# Altium schematic sheet [10] - FPGA IO BANK 3A.SchDoc
size A3; DocumentNumber: 10; SheetNumber: 10; SheetTotal: 15
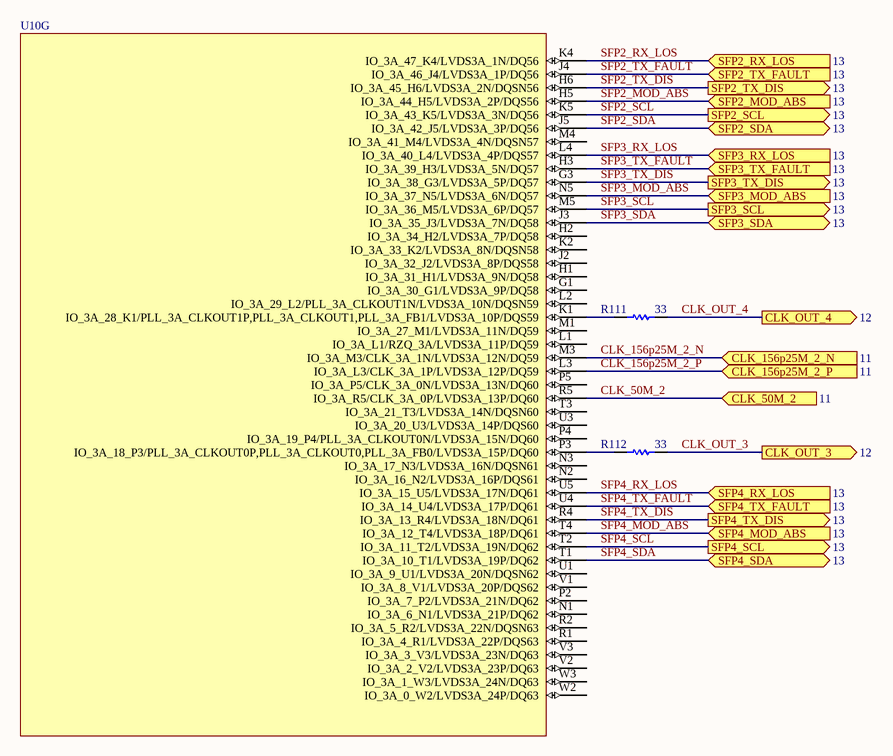
[diagram p0: [10] - FPGA IO BANK 3A.SchDoc]

## Parts
R111  33  [0402_R]
R112  33  [0402_R]
U10  10AX016 F27  [FBGA672]  (value not drawn)  (part G of 12)

## Ports
CLK_50M_2 (in, see 11), CLK_156p25M_2_N (in, see 11), CLK_156p25M_2_P (in, see 11), CLK_OUT_3 (out, see 12), CLK_OUT_4 (out, see 12), SFP2_MOD_ABS (in, see 13), SFP2_RX_LOS (in, see 13), SFP2_SCL (out, see 13), SFP2_SDA (bidir, see 13), SFP2_TX_DIS (out, see 13), SFP2_TX_FAULT (in, see 13), SFP3_MOD_ABS (in, see 13), SFP3_RX_LOS (in, see 13), SFP3_SCL (out, see 13), SFP3_SDA (bidir, see 13), SFP3_TX_DIS (out, see 13), SFP3_TX_FAULT (in, see 13), SFP4_MOD_ABS (in, see 13), SFP4_RX_LOS (in, see 13), SFP4_SCL (out, see 13), SFP4_SDA (bidir, see 13), SFP4_TX_DIS (out, see 13), SFP4_TX_FAULT (in, see 13)

## Nets
CLK_50M_2: U10.R5(IO_3A_R5/CLK_3A_0P/LVDS3A_13P/DQ60) ; port CLK_50M_2
CLK_156p25M_2_N: U10.M3(IO_3A_M3/CLK_3A_1N/LVDS3A_12N/DQ59) ; port CLK_156p25M_2_N
CLK_156p25M_2_P: U10.L3(IO_3A_L3/CLK_3A_1P/LVDS3A_12P/DQ59) ; port CLK_156p25M_2_P
CLK_OUT_3: R112.2 ; port CLK_OUT_3
CLK_OUT_4: R111.2 ; port CLK_OUT_4
SFP2_MOD_ABS: U10.H5(IO_3A_44_H5/LVDS3A_2P/DQS56) ; port SFP2_MOD_ABS
SFP2_RX_LOS: U10.K4(IO_3A_47_K4/LVDS3A_1N/DQ56) ; port SFP2_RX_LOS
SFP2_SCL: U10.K5(IO_3A_43_K5/LVDS3A_3N/DQ56) ; port SFP2_SCL
SFP2_SDA: U10.J5(IO_3A_42_J5/LVDS3A_3P/DQ56) ; port SFP2_SDA
SFP2_TX_DIS: U10.H6(IO_3A_45_H6/LVDS3A_2N/DQSN56) ; port SFP2_TX_DIS
SFP2_TX_FAULT: U10.J4(IO_3A_46_J4/LVDS3A_1P/DQ56) ; port SFP2_TX_FAULT
SFP3_MOD_ABS: U10.N5(IO_3A_37_N5/LVDS3A_6N/DQ57) ; port SFP3_MOD_ABS
SFP3_RX_LOS: U10.L4(IO_3A_40_L4/LVDS3A_4P/DQS57) ; port SFP3_RX_LOS
SFP3_SCL: U10.M5(IO_3A_36_M5/LVDS3A_6P/DQ57) ; port SFP3_SCL
SFP3_SDA: U10.J3(IO_3A_35_J3/LVDS3A_7N/DQ58) ; port SFP3_SDA
SFP3_TX_DIS: U10.G3(IO_3A_38_G3/LVDS3A_5P/DQ57) ; port SFP3_TX_DIS
SFP3_TX_FAULT: U10.H3(IO_3A_39_H3/LVDS3A_5N/DQ57) ; port SFP3_TX_FAULT
SFP4_MOD_ABS: U10.T4(IO_3A_12_T4/LVDS3A_18P/DQ61) ; port SFP4_MOD_ABS
SFP4_RX_LOS: U10.U5(IO_3A_15_U5/LVDS3A_17N/DQ61) ; port SFP4_RX_LOS
SFP4_SCL: U10.T2(IO_3A_11_T2/LVDS3A_19N/DQ62) ; port SFP4_SCL
SFP4_SDA: U10.T1(IO_3A_10_T1/LVDS3A_19P/DQ62) ; port SFP4_SDA
SFP4_TX_DIS: U10.R4(IO_3A_13_R4/LVDS3A_18N/DQ61) ; port SFP4_TX_DIS
SFP4_TX_FAULT: U10.U4(IO_3A_14_U4/LVDS3A_17P/DQ61) ; port SFP4_TX_FAULT
NetR111_1: R111.1 U10.K1(IO_3A_28_K1/PLL_3A_CLKOUT1P,PLL_3A_CLKOUT1,PLL_3A_FB1/LVDS3A_10P/DQS59)
NetR112_1: R112.1 U10.P3(IO_3A_18_P3/PLL_3A_CLKOUT0P,PLL_3A_CLKOUT0,PLL_3A_FB0/LVDS3A_15P/DQ60)

Not connected (* = marked no-connect by the designer): U10 G1(IO_3A_30_G1/LVDS3A_9P/DQ58) H1(IO_3A_31_H1/LVDS3A_9N/DQ58) H2(IO_3A_34_H2/LVDS3A_7P/DQ58) J2(IO_3A_32_J2/LVDS3A_8P/DQS58) K2(IO_3A_33_K2/LVDS3A_8N/DQSN58) L1(IO_3A_L1/RZQ_3A/LVDS3A_11P/DQ59) L2(IO_3A_29_L2/PLL_3A_CLKOUT1N/LVDS3A_10N/DQSN59) M1(IO_3A_27_M1/LVDS3A_11N/DQ59) M4(IO_3A_41_M4/LVDS3A_4N/DQSN57) N1(IO_3A_6_N1/LVDS3A_21P/DQ62) N2(IO_3A_16_N2/LVDS3A_16P/DQS61) N3(IO_3A_17_N3/LVDS3A_16N/DQSN61) P2(IO_3A_7_P2/LVDS3A_21N/DQ62) P4(IO_3A_19_P4/PLL_3A_CLKOUT0N/LVDS3A_15N/DQ60) P5(IO_3A_P5/CLK_3A_0N/LVDS3A_13N/DQ60) R1(IO_3A_4_R1/LVDS3A_22P/DQS63) R2(IO_3A_5_R2/LVDS3A_22N/DQSN63) T3(IO_3A_21_T3/LVDS3A_14N/DQSN60) U1(IO_3A_9_U1/LVDS3A_20N/DQSN62) U3(IO_3A_20_U3/LVDS3A_14P/DQS60) V1(IO_3A_8_V1/LVDS3A_20P/DQS62) V2(IO_3A_2_V2/LVDS3A_23P/DQ63) V3(IO_3A_3_V3/LVDS3A_23N/DQ63) W2(IO_3A_0_W2/LVDS3A_24P/DQ63) W3(IO_3A_1_W3/LVDS3A_24N/DQ63)

## Library data of the parts
R111 R112 = Res SMD: SMD Resistor; Tolerance: 5%; Value: 33; Manufacturer Part Num: *
U10 = 10AX016: Value: 10AX016 F27; Manufacturer Part Num: *